# Altium schematic sheet Sheet.SchDoc
size 209 x 297 mm; Scale: 1:1; DocumentType: Схема электрическая принципиальная; FirstReferrence: АБВГ.123456.001
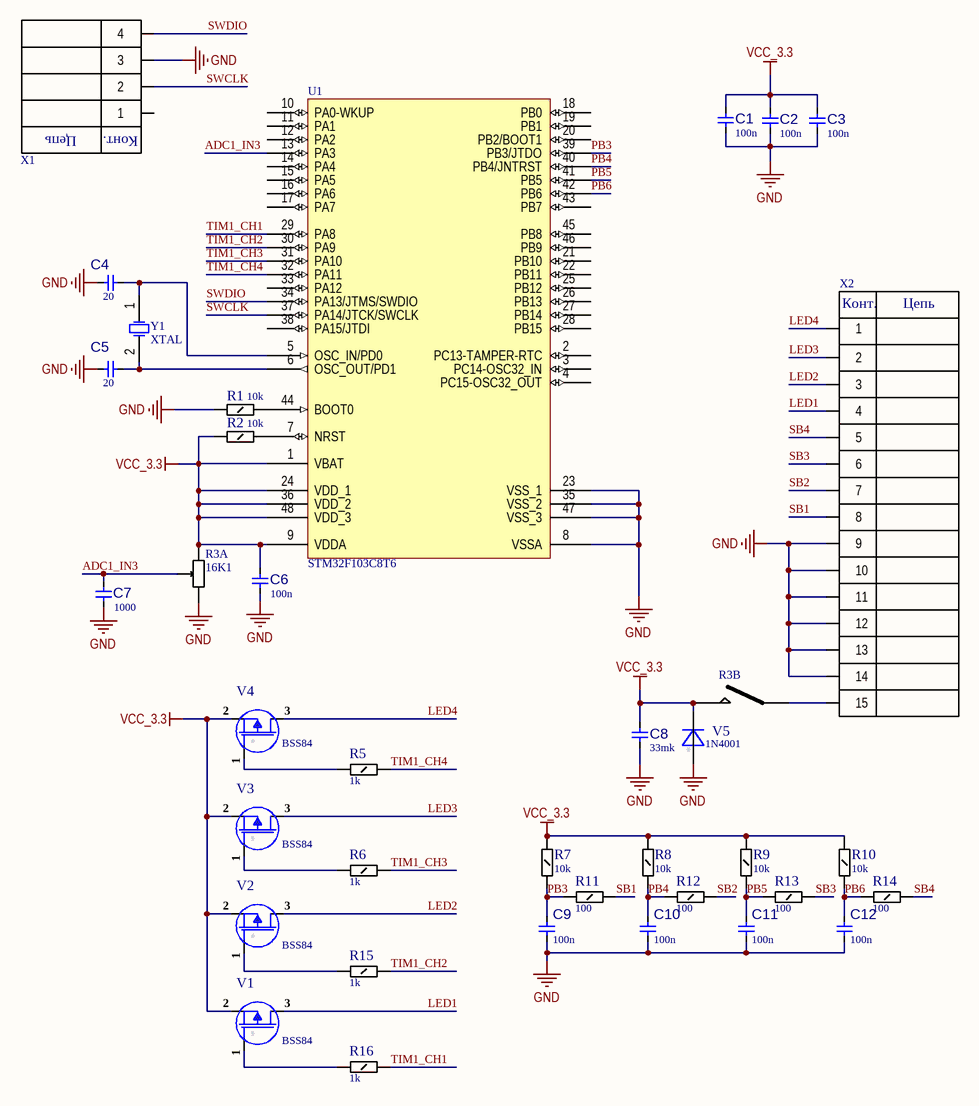
[diagram p0: Sheet.SchDoc]

## Parts
C1  value 100n  [C1206]  (hidden comment: C1206)
C2  value 100n  [C1206]  (hidden comment: C1206)
C3  value 100n  [C1206]  (hidden comment: C1206)
C4  value 20  [C1206]  (hidden comment: C1206)
C5  value 20  [C1206]  (hidden comment: C1206)
C6  value 100n  [C1206]  (hidden comment: C1206)
C7  value 1000  [C1206]  (hidden comment: C1206)
C8  33mk  [C1210]
C9  value 100n  [C1206]  (hidden comment: C1206)
C10  value 100n  [C1206]  (hidden comment: C1206)
C11  value 100n  [C1206]  (hidden comment: C1206)
C12  value 100n  [C1206]  (hidden comment: C1206)
R1  value 10k  [R1206]  (hidden comment: R1206-0,25 W)
R2  value 10k  [R1206]  (hidden comment: R1206-0,25 W)
R3  16K1  [S16KN1]  (parts A,B of 2)
R5  value 1k  [R1206]  (hidden comment: R1206-0,25 W)
R6  value 1k  [R1206]  (hidden comment: R1206-0,25 W)
R7  value 10k  [R1206]  (hidden comment: R1206-0,25 W)
R8  value 10k  [R1206]  (hidden comment: R1206-0,25 W)
R9  value 10k  [R1206]  (hidden comment: R1206-0,25 W)
R10  value 10k  [R1206]  (hidden comment: R1206-0,25 W)
R11  value 100  [R1206]  (hidden comment: R1206-0,25 W)
R12  value 100  [R1206]  (hidden comment: R1206-0,25 W)
R13  value 100  [R1206]  (hidden comment: R1206-0,25 W)
R14  value 100  [R1206]  (hidden comment: R1206-0,25 W)
R15  value 1k  [R1206]  (hidden comment: R1206-0,25 W)
R16  value 1k  [R1206]  (hidden comment: R1206-0,25 W)
U1  STM32F103C8T6  [LQFP48_N]
V1  BSS84  [SOT-23]
V2  BSS84  [SOT-23]
V3  BSS84  [SOT-23]
V4  BSS84  [SOT-23]
V5  1N4001  [doid]
X1  PLS-4R  [PLS-4R]  (value not drawn)
X2  sourse  [DHR15-FB]  (value not drawn)
Y1  XTAL  [HC49/4H_SMX]

## Nets
GND: C1.1 C2.1 C3.1 C4.1 C5.1 C6.1 C7.1 C8.1 C9.1 C10.1 C11.1 C12.1 R1.1 R3.1 U1.8(VSSA) U1.23(VSS_1) U1.35(VSS_2) U1.47(VSS_3) V5.2(A) X1.3 X2.9 X2.10 X2.11 X2.12 X2.13 X2.14
VCC_3.3: C1.2 C2.2 C3.2 C6.2 C8.2 R2.1 R3.3 R3.4 R7.2 R8.2 R9.2 R10.2 U1.1(VBAT) U1.9(VDDA) U1.24(VDD_1) U1.36(VDD_2) U1.48(VDD_3) V1.2(S) V2.2(S) V3.2(S) V4.2(S) V5.1(K)
ADC1_IN3: C7.2 R3.2 U1.13(PA3)
LED1: V1.3(D) X2.4
LED2: V2.3(D) X2.3
LED3: V3.3(D) X2.2
LED4: V4.3(D) X2.1
PB3: C9.2 R7.1 R11.2 U1.39(PB3/JTDO)
PB4: C10.2 R8.1 R12.2 U1.40(PB4/JNTRST)
PB5: C11.2 R9.1 R13.2 U1.41(PB5)
PB6: C12.2 R10.1 R14.2 U1.42(PB6)
SB1: R11.1 X2.8
SB2: R12.1 X2.7
SB3: R13.1 X2.6
SB4: R14.1 X2.5
SWCLK: U1.37(PA14/JTCK/SWCLK) X1.2
SWDIO: U1.34(PA13/JTMS/SWDIO) X1.4
TIM1_CH1: R16.1 U1.29(PA8)
TIM1_CH2: R15.1 U1.30(PA9)
TIM1_CH3: R6.1 U1.31(PA10)
TIM1_CH4: R5.1 U1.32(PA11)
NetC4_2: C4.2 U1.5(OSC_IN/PD0) Y1.1(OSC1)
NetC5_2: C5.2 U1.6(OSC_OUT/PD1) Y1.2(OSC2)
NetR1_2: R1.2 U1.44(BOOT0)
NetR2_2: R2.2 U1.7(NRST)
NetR3_5: R3.5 X2.15
NetR5_2: R5.2 V4.1(G)
NetR6_2: R6.2 V3.1(G)
NetR15_2: R15.2 V2.1(G)
NetR16_2: R16.2 V1.1(G)

Not connected (* = marked no-connect by the designer): U1 2(PC13-TAMPER-RTC) 3(PC14-OSC32_IN) 4(PC15-OSC32_OUT) 10(PA0-WKUP) 11(PA1) 12(PA2) 14(PA4) 15(PA5) 16(PA6) 17(PA7) 18(PB0) 19(PB1) 20(PB2/BOOT1) 21(PB10) 22(PB11) 25(PB12) 26(PB13) 27(PB14) 28(PB15) 33(PA12) 38(PA15/JTDI) 43(PB7) 45(PB8) 46(PB9); X1 1

## Notes on the sheet
- Перв. примен.
- Справ. №
- Подп. и дата
- Инв. № дубл.
- Взам. инв. №
- Разраб.
- Изм.
- Лист
- № докум.
- Подп.
- Дата
- Лит.
- Масса
- Масштаб
- Пров.
- Т.контр.
- Листов
- Инв. № подл.
- Утв.
- Н.контр.
- 2.106-A4
- Копировал
- Формат А4
- (in symbol DHR-15FB) Конт.; Цепь
- (in symbol Разъем PLS-4R) Цепь; Конт.

## Library data of the parts
C1-C3 C6 C7 C9-C12 = Condensator 1206 100: TitAD: Конденсатор; Part Number: Condensator 1206 100
C4 C5 = Condensator 1206 20: TitAD: Конденсатор; Part Number: Condensator 1206 20
C8 = Condensator 1210 33mk: TitAD: Конденсатор; Value: 33mk; Part Number: Condensator 1210 33mk
R1 R2 R5-R16 = Resistor 1206 10k: TitAD: Резистор; Part Number: Resistor 1206 10k
R3 = Resistor S16KN1: Value: 10k; TitAD: Резистор; Part Number: Resistor S16KN1; Корпус: 16K1
U1 = STM32F103C8T6: STM32 ARM-based 32-bit MCU with 64 Kbytes Flash, 48-pin LQFP, Industrial Temperature; Published: 30-May-2008; DatasheetVersion: rev6, Mar-2008; PackageVersion: Mar-2008; PackageReference: LQFP48; Publisher: Altium Limited; PackageDescription: 48-Pin Low-Profile Quad Flat Pack, 7 x 7 mm Body, 0.5 mm Pitch (LQFP48); ComponentLink1Description: Manufacturer Link; ComponentLink1URL: www.st.com/stm32; ComponentLink2Description: Datasheet; ComponentLink2URL: http://www.st.com/stonline/products/literature/ds/13587.pdf
V1-V4 = BSS84: TitAD: Транзистор; Supplier 1: Farnell; Supplier Part Number 1: 1510765; Part Number: BSS84; ManufacturerPartNumber: BSS84; Корпус: SOT-23
V5 = 1N4007: Part Number: 1N4007; TitAD: диод; Supplier 1: Mouser; Supplier Part Number 1: 625-1N4007E-E3/73
X1 = Разъем PLS-4R: TitAD: Разъем; Part Number: Разъем PLS-4R
X2 = DHR-15FB: TitAD: Разъем; Part Number: DHR-15FB
Y1 = XTAL: Crystal Oscillator; Published: 8-Jun-2000; LatestRevisionDate: 17-Jul-2002; LatestRevisionNote: Re-released for DXP Platform.; PackageReference: R38; Publisher: Altium Limited; PackageDescription: Crystal, Thru-Hole; 2 Leads; Body 3.1 x 8.2 mm (Dia.xH)